# EAGLE design WordclockKopie (EAGLE 7.2.0)
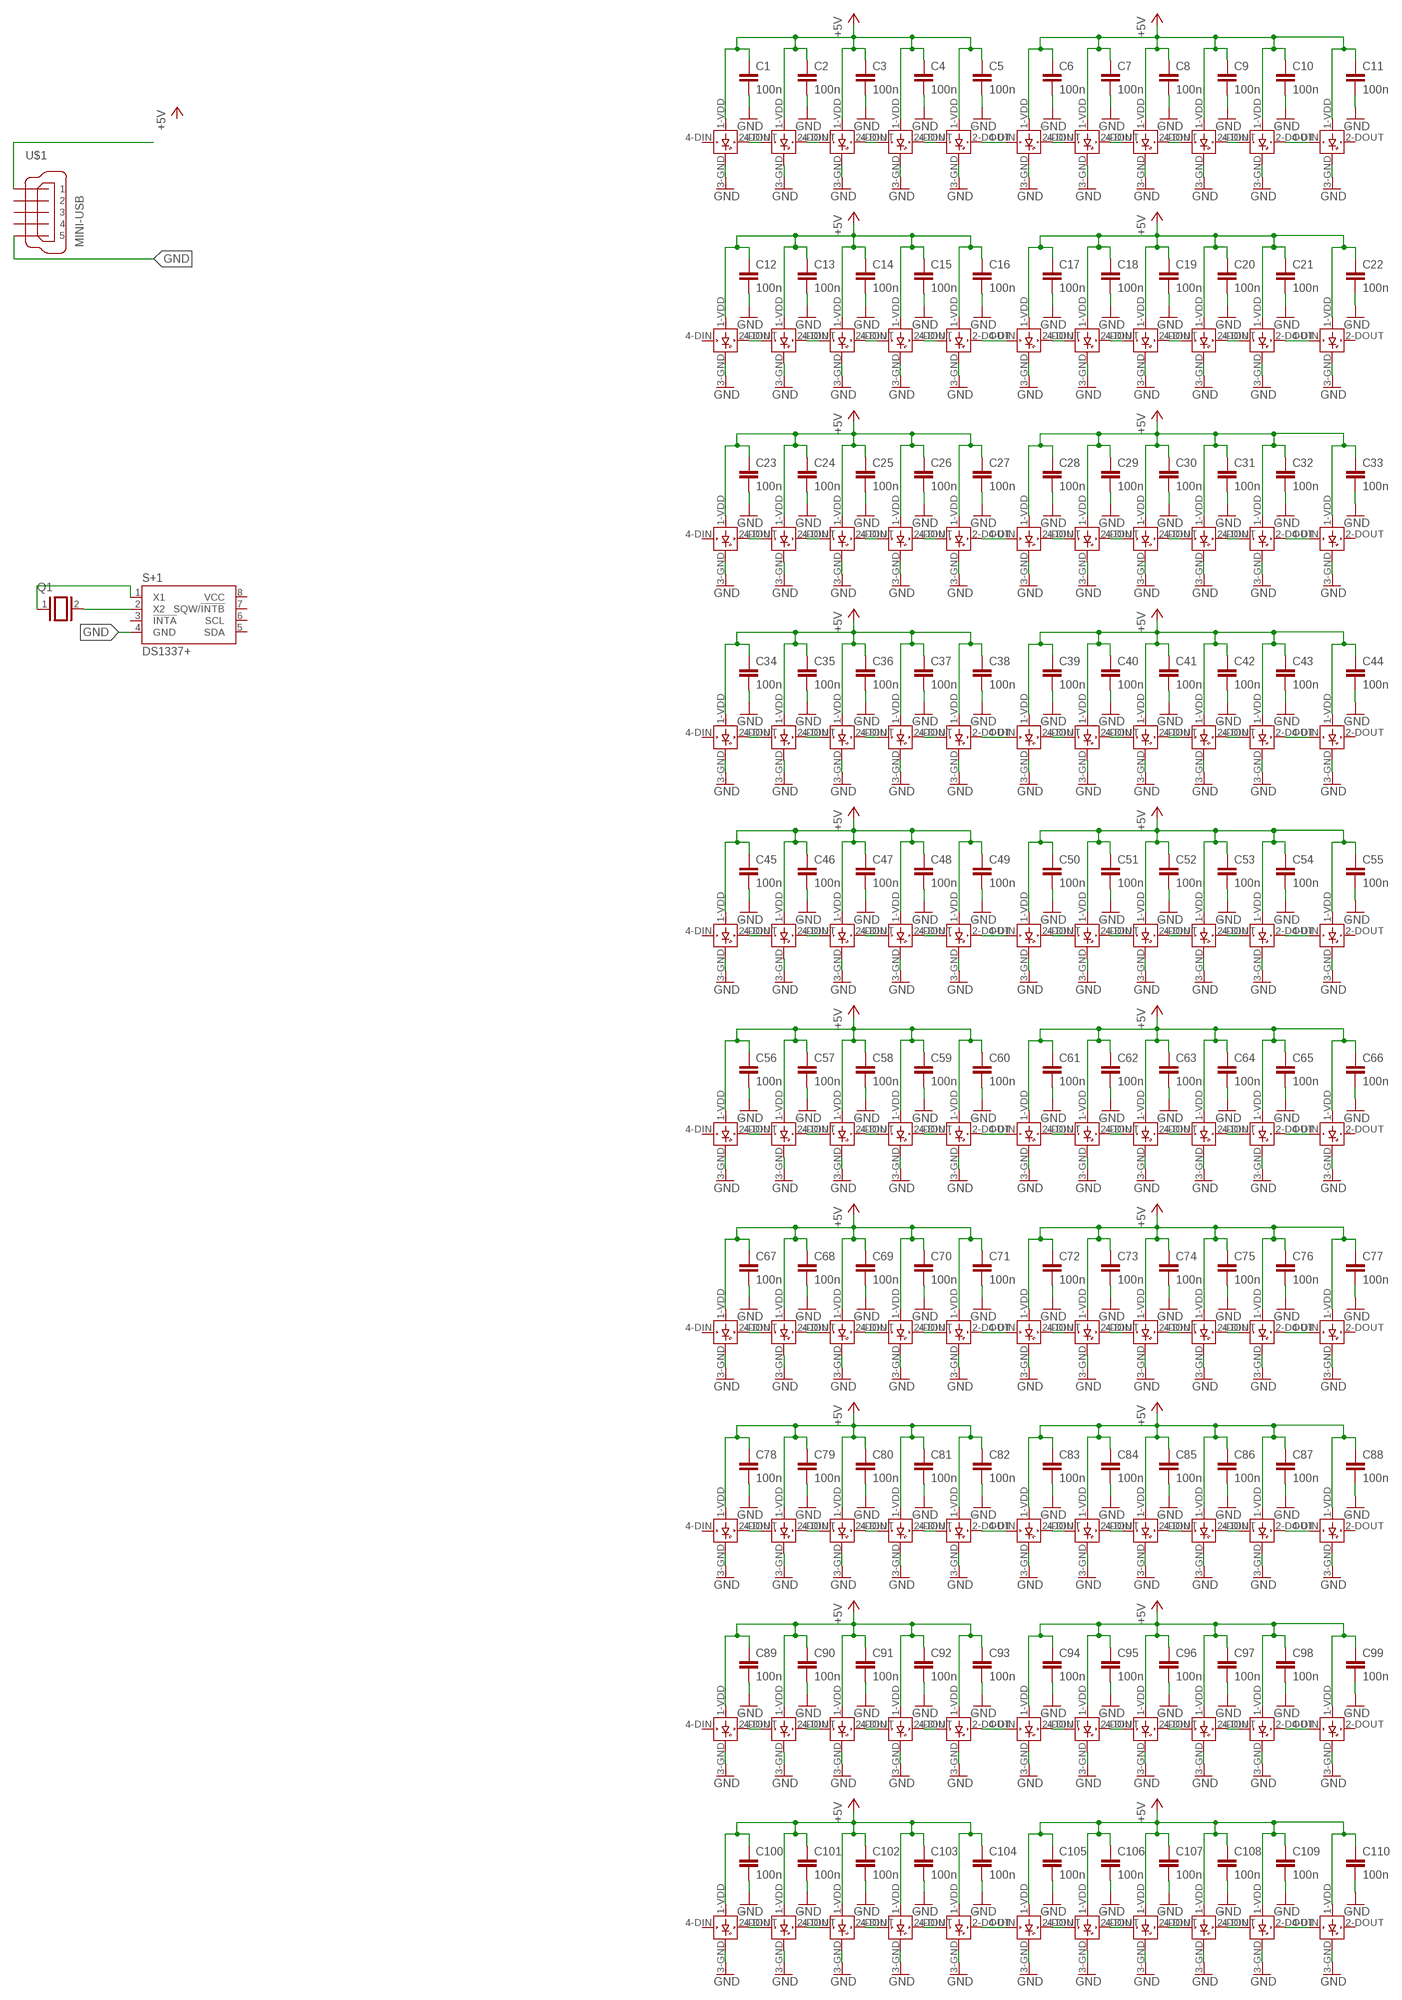
[diagram p0: schematic, sheet 1]

## Parts
C1  100n  C-EUC1310  [C1310]
C2  100n  C-EUC1310  [C1310]
C3  100n  C-EUC1310  [C1310]
C4  100n  C-EUC1310  [C1310]
C5  100n  C-EUC1310  [C1310]
C6  100n  C-EUC1310  [C1310]
C7  100n  C-EUC1310  [C1310]
C8  100n  C-EUC1310  [C1310]
C9  100n  C-EUC1310  [C1310]
C10  100n  C-EUC1310  [C1310]
C11  100n  C-EUC1310  [C1310]
C12  100n  C-EUC1310  [C1310]
C13  100n  C-EUC1310  [C1310]
C14  100n  C-EUC1310  [C1310]
C15  100n  C-EUC1310  [C1310]
C16  100n  C-EUC1310  [C1310]
C17  100n  C-EUC1310  [C1310]
C18  100n  C-EUC1310  [C1310]
C19  100n  C-EUC1310  [C1310]
C20  100n  C-EUC1310  [C1310]
C21  100n  C-EUC1310  [C1310]
C22  100n  C-EUC1310  [C1310]
C23  100n  C-EUC1310  [C1310]
C24  100n  C-EUC1310  [C1310]
C25  100n  C-EUC1310  [C1310]
C26  100n  C-EUC1310  [C1310]
C27  100n  C-EUC1310  [C1310]
C28  100n  C-EUC1310  [C1310]
C29  100n  C-EUC1310  [C1310]
C30  100n  C-EUC1310  [C1310]
C31  100n  C-EUC1310  [C1310]
C32  100n  C-EUC1310  [C1310]
C33  100n  C-EUC1310  [C1310]
C34  100n  C-EUC1310  [C1310]
C35  100n  C-EUC1310  [C1310]
C36  100n  C-EUC1310  [C1310]
C37  100n  C-EUC1310  [C1310]
C38  100n  C-EUC1310  [C1310]
C39  100n  C-EUC1310  [C1310]
C40  100n  C-EUC1310  [C1310]
C41  100n  C-EUC1310  [C1310]
C42  100n  C-EUC1310  [C1310]
C43  100n  C-EUC1310  [C1310]
C44  100n  C-EUC1310  [C1310]
C45  100n  C-EUC1310  [C1310]
C46  100n  C-EUC1310  [C1310]
C47  100n  C-EUC1310  [C1310]
C48  100n  C-EUC1310  [C1310]
C49  100n  C-EUC1310  [C1310]
C50  100n  C-EUC1310  [C1310]
C51  100n  C-EUC1310  [C1310]
C52  100n  C-EUC1310  [C1310]
C53  100n  C-EUC1310  [C1310]
C54  100n  C-EUC1310  [C1310]
C55  100n  C-EUC1310  [C1310]
C56  100n  C-EUC1310  [C1310]
C57  100n  C-EUC1310  [C1310]
C58  100n  C-EUC1310  [C1310]
C59  100n  C-EUC1310  [C1310]
C60  100n  C-EUC1310  [C1310]
C61  100n  C-EUC1310  [C1310]
C62  100n  C-EUC1310  [C1310]
C63  100n  C-EUC1310  [C1310]
C64  100n  C-EUC1310  [C1310]
C65  100n  C-EUC1310  [C1310]
C66  100n  C-EUC1310  [C1310]
C67  100n  C-EUC1310  [C1310]
C68  100n  C-EUC1310  [C1310]
C69  100n  C-EUC1310  [C1310]
C70  100n  C-EUC1310  [C1310]
C71  100n  C-EUC1310  [C1310]
C72  100n  C-EUC1310  [C1310]
C73  100n  C-EUC1310  [C1310]
C74  100n  C-EUC1310  [C1310]
C75  100n  C-EUC1310  [C1310]
C76  100n  C-EUC1310  [C1310]
C77  100n  C-EUC1310  [C1310]
C78  100n  C-EUC1310  [C1310]
C79  100n  C-EUC1310  [C1310]
C80  100n  C-EUC1310  [C1310]
C81  100n  C-EUC1310  [C1310]
C82  100n  C-EUC1310  [C1310]
C83  100n  C-EUC1310  [C1310]
C84  100n  C-EUC1310  [C1310]
C85  100n  C-EUC1310  [C1310]
C86  100n  C-EUC1310  [C1310]
C87  100n  C-EUC1310  [C1310]
C88  100n  C-EUC1310  [C1310]
C89  100n  C-EUC1310  [C1310]
C90  100n  C-EUC1310  [C1310]
C91  100n  C-EUC1310  [C1310]
C92  100n  C-EUC1310  [C1310]
C93  100n  C-EUC1310  [C1310]
C94  100n  C-EUC1310  [C1310]
C95  100n  C-EUC1310  [C1310]
C96  100n  C-EUC1310  [C1310]
C97  100n  C-EUC1310  [C1310]
C98  100n  C-EUC1310  [C1310]
C99  100n  C-EUC1310  [C1310]
C100  100n  C-EUC1310  [C1310]
C101  100n  C-EUC1310  [C1310]
C102  100n  C-EUC1310  [C1310]
C103  100n  C-EUC1310  [C1310]
C104  100n  C-EUC1310  [C1310]
C105  100n  C-EUC1310  [C1310]
C106  100n  C-EUC1310  [C1310]
C107  100n  C-EUC1310  [C1310]
C108  100n  C-EUC1310  [C1310]
C109  100n  C-EUC1310  [C1310]
C110  100n  C-EUC1310  [C1310]
L1  WS2812B  [WS2812B]
L2  WS2812B  [WS2812B]
L3  WS2812B  [WS2812B]
L4  WS2812B  [WS2812B]
L5  WS2812B  [WS2812B]
L6  WS2812B  [WS2812B]
L7  WS2812B  [WS2812B]
L8  WS2812B  [WS2812B]
L9  WS2812B  [WS2812B]
L10  WS2812B  [WS2812B]
L11  WS2812B  [WS2812B]
L12  WS2812B  [WS2812B]
L13  WS2812B  [WS2812B]
L14  WS2812B  [WS2812B]
L15  WS2812B  [WS2812B]
L16  WS2812B  [WS2812B]
L17  WS2812B  [WS2812B]
L18  WS2812B  [WS2812B]
L19  WS2812B  [WS2812B]
L20  WS2812B  [WS2812B]
L21  WS2812B  [WS2812B]
L22  WS2812B  [WS2812B]
L23  WS2812B  [WS2812B]
L24  WS2812B  [WS2812B]
L25  WS2812B  [WS2812B]
L26  WS2812B  [WS2812B]
L27  WS2812B  [WS2812B]
L28  WS2812B  [WS2812B]
L29  WS2812B  [WS2812B]
L30  WS2812B  [WS2812B]
L31  WS2812B  [WS2812B]
L32  WS2812B  [WS2812B]
L33  WS2812B  [WS2812B]
L34  WS2812B  [WS2812B]
L35  WS2812B  [WS2812B]
L36  WS2812B  [WS2812B]
L37  WS2812B  [WS2812B]
L38  WS2812B  [WS2812B]
L39  WS2812B  [WS2812B]
L40  WS2812B  [WS2812B]
L41  WS2812B  [WS2812B]
L42  WS2812B  [WS2812B]
L43  WS2812B  [WS2812B]
L44  WS2812B  [WS2812B]
L45  WS2812B  [WS2812B]
L46  WS2812B  [WS2812B]
L47  WS2812B  [WS2812B]
L48  WS2812B  [WS2812B]
L49  WS2812B  [WS2812B]
L50  WS2812B  [WS2812B]
L51  WS2812B  [WS2812B]
L52  WS2812B  [WS2812B]
L53  WS2812B  [WS2812B]
L54  WS2812B  [WS2812B]
L55  WS2812B  [WS2812B]
L56  WS2812B  [WS2812B]
L57  WS2812B  [WS2812B]
L58  WS2812B  [WS2812B]
L59  WS2812B  [WS2812B]
L60  WS2812B  [WS2812B]
L61  WS2812B  [WS2812B]
L62  WS2812B  [WS2812B]
L63  WS2812B  [WS2812B]
L64  WS2812B  [WS2812B]
L65  WS2812B  [WS2812B]
L66  WS2812B  [WS2812B]
L67  WS2812B  [WS2812B]
L68  WS2812B  [WS2812B]
L69  WS2812B  [WS2812B]
L70  WS2812B  [WS2812B]
L71  WS2812B  [WS2812B]
L72  WS2812B  [WS2812B]
L73  WS2812B  [WS2812B]
L74  WS2812B  [WS2812B]
L75  WS2812B  [WS2812B]
L76  WS2812B  [WS2812B]
L77  WS2812B  [WS2812B]
L78  WS2812B  [WS2812B]
L79  WS2812B  [WS2812B]
L80  WS2812B  [WS2812B]
L81  WS2812B  [WS2812B]
L82  WS2812B  [WS2812B]
L83  WS2812B  [WS2812B]
L84  WS2812B  [WS2812B]
L85  WS2812B  [WS2812B]
L86  WS2812B  [WS2812B]
L87  WS2812B  [WS2812B]
L88  WS2812B  [WS2812B]
L89  WS2812B  [WS2812B]
L90  WS2812B  [WS2812B]
L91  WS2812B  [WS2812B]
L92  WS2812B  [WS2812B]
L93  WS2812B  [WS2812B]
L94  WS2812B  [WS2812B]
L95  WS2812B  [WS2812B]
L96  WS2812B  [WS2812B]
L97  WS2812B  [WS2812B]
L98  WS2812B  [WS2812B]
L99  WS2812B  [WS2812B]
L100  WS2812B  [WS2812B]
L101  WS2812B  [WS2812B]
L102  WS2812B  [WS2812B]
L103  WS2812B  [WS2812B]
L104  WS2812B  [WS2812B]
L105  WS2812B  [WS2812B]
L106  WS2812B  [WS2812B]
L107  WS2812B  [WS2812B]
L108  WS2812B  [WS2812B]
L109  WS2812B  [WS2812B]
L110  WS2812B  [WS2812B]
Q1  XTAL  [Q]
S+1  DS1337+  [DIL8]
U$1  MINI-USB  [MINI-USB]

## Nets
+5V: C1.1 C2.1 C3.1 C4.1 C5.1 C6.1 C7.1 C8.1 C9.1 C10.1 C11.1 C12.1 C13.1 C14.1 C15.1 C16.1 C17.1 C18.1 C19.1 C20.1 C21.1 C22.1 C23.1 C24.1 C25.1 C26.1 C27.1 C28.1 C29.1 C30.1 C31.1 C32.1 C33.1 C34.1 C35.1 C36.1 C37.1 C38.1 C39.1 C40.1 C41.1 C42.1 C43.1 C44.1 C45.1 C46.1 C47.1 C48.1 C49.1 C50.1 C51.1 C52.1 C53.1 C54.1 C55.1 C56.1 C57.1 C58.1 C59.1 C60.1 C61.1 C62.1 C63.1 C64.1 C65.1 C66.1 C67.1 C68.1 C69.1 C70.1 C71.1 C72.1 C73.1 C74.1 C75.1 C76.1 C77.1 C78.1 C79.1 C80.1 C81.1 C82.1 C83.1 C84.1 C85.1 C86.1 C87.1 C88.1 C89.1 C90.1 C91.1 C92.1 C93.1 C94.1 C95.1 C96.1 C97.1 C98.1 C99.1 C100.1 C101.1 C102.1 C103.1 C104.1 C105.1 C106.1 C107.1 C108.1 C109.1 C110.1 L1.1-VDD(VDD) L2.1-VDD(VDD) L3.1-VDD(VDD) L4.1-VDD(VDD) L5.1-VDD(VDD) L6.1-VDD(VDD) L7.1-VDD(VDD) L8.1-VDD(VDD) L9.1-VDD(VDD) L10.1-VDD(VDD) L11.1-VDD(VDD) L12.1-VDD(VDD) L13.1-VDD(VDD) L14.1-VDD(VDD) L15.1-VDD(VDD) L16.1-VDD(VDD) L17.1-VDD(VDD) L18.1-VDD(VDD) L19.1-VDD(VDD) L20.1-VDD(VDD) L21.1-VDD(VDD) L22.1-VDD(VDD) L23.1-VDD(VDD) L24.1-VDD(VDD) L25.1-VDD(VDD) L26.1-VDD(VDD) L27.1-VDD(VDD) L28.1-VDD(VDD) L29.1-VDD(VDD) L30.1-VDD(VDD) L31.1-VDD(VDD) L32.1-VDD(VDD) L33.1-VDD(VDD) L34.1-VDD(VDD) L35.1-VDD(VDD) L36.1-VDD(VDD) L37.1-VDD(VDD) L38.1-VDD(VDD) L39.1-VDD(VDD) L40.1-VDD(VDD) L41.1-VDD(VDD) L42.1-VDD(VDD) L43.1-VDD(VDD) L44.1-VDD(VDD) L45.1-VDD(VDD) L46.1-VDD(VDD) L47.1-VDD(VDD) L48.1-VDD(VDD) L49.1-VDD(VDD) L50.1-VDD(VDD) L51.1-VDD(VDD) L52.1-VDD(VDD) L53.1-VDD(VDD) L54.1-VDD(VDD) L55.1-VDD(VDD) L56.1-VDD(VDD) L57.1-VDD(VDD) L58.1-VDD(VDD) L59.1-VDD(VDD) L60.1-VDD(VDD) L61.1-VDD(VDD) L62.1-VDD(VDD) L63.1-VDD(VDD) L64.1-VDD(VDD) L65.1-VDD(VDD) L66.1-VDD(VDD) L67.1-VDD(VDD) L68.1-VDD(VDD) L69.1-VDD(VDD) L70.1-VDD(VDD) L71.1-VDD(VDD) L72.1-VDD(VDD) L73.1-VDD(VDD) L74.1-VDD(VDD) L75.1-VDD(VDD) L76.1-VDD(VDD) L77.1-VDD(VDD) L78.1-VDD(VDD) L79.1-VDD(VDD) L80.1-VDD(VDD) L81.1-VDD(VDD) L82.1-VDD(VDD) L83.1-VDD(VDD) L84.1-VDD(VDD) L85.1-VDD(VDD) L86.1-VDD(VDD) L87.1-VDD(VDD) L88.1-VDD(VDD) L89.1-VDD(VDD) L90.1-VDD(VDD) L91.1-VDD(VDD) L92.1-VDD(VDD) L93.1-VDD(VDD) L94.1-VDD(VDD) L95.1-VDD(VDD) L96.1-VDD(VDD) L97.1-VDD(VDD) L98.1-VDD(VDD) L99.1-VDD(VDD) L100.1-VDD(VDD) L101.1-VDD(VDD) L102.1-VDD(VDD) L103.1-VDD(VDD) L104.1-VDD(VDD) L105.1-VDD(VDD) L106.1-VDD(VDD) L107.1-VDD(VDD) L108.1-VDD(VDD) L109.1-VDD(VDD) L110.1-VDD(VDD)
GND: C1.2 C2.2 C3.2 C4.2 C5.2 C6.2 C7.2 C8.2 C9.2 C10.2 C11.2 C12.2 C13.2 C14.2 C15.2 C16.2 C17.2 C18.2 C19.2 C20.2 C21.2 C22.2 C23.2 C24.2 C25.2 C26.2 C27.2 C28.2 C29.2 C30.2 C31.2 C32.2 C33.2 C34.2 C35.2 C36.2 C37.2 C38.2 C39.2 C40.2 C41.2 C42.2 C43.2 C44.2 C45.2 C46.2 C47.2 C48.2 C49.2 C50.2 C51.2 C52.2 C53.2 C54.2 C55.2 C56.2 C57.2 C58.2 C59.2 C60.2 C61.2 C62.2 C63.2 C64.2 C65.2 C66.2 C67.2 C68.2 C69.2 C70.2 C71.2 C72.2 C73.2 C74.2 C75.2 C76.2 C77.2 C78.2 C79.2 C80.2 C81.2 C82.2 C83.2 C84.2 C85.2 C86.2 C87.2 C88.2 C89.2 C90.2 C91.2 C92.2 C93.2 C94.2 C95.2 C96.2 C97.2 C98.2 C99.2 C100.2 C101.2 C102.2 C103.2 C104.2 C105.2 C106.2 C107.2 C108.2 C109.2 C110.2 L1.3-GND(GND) L2.3-GND(GND) L3.3-GND(GND) L4.3-GND(GND) L5.3-GND(GND) L6.3-GND(GND) L7.3-GND(GND) L8.3-GND(GND) L9.3-GND(GND) L10.3-GND(GND) L11.3-GND(GND) L12.3-GND(GND) L13.3-GND(GND) L14.3-GND(GND) L15.3-GND(GND) L16.3-GND(GND) L17.3-GND(GND) L18.3-GND(GND) L19.3-GND(GND) L20.3-GND(GND) L21.3-GND(GND) L22.3-GND(GND) L23.3-GND(GND) L24.3-GND(GND) L25.3-GND(GND) L26.3-GND(GND) L27.3-GND(GND) L28.3-GND(GND) L29.3-GND(GND) L30.3-GND(GND) L31.3-GND(GND) L32.3-GND(GND) L33.3-GND(GND) L34.3-GND(GND) L35.3-GND(GND) L36.3-GND(GND) L37.3-GND(GND) L38.3-GND(GND) L39.3-GND(GND) L40.3-GND(GND) L41.3-GND(GND) L42.3-GND(GND) L43.3-GND(GND) L44.3-GND(GND) L45.3-GND(GND) L46.3-GND(GND) L47.3-GND(GND) L48.3-GND(GND) L49.3-GND(GND) L50.3-GND(GND) L51.3-GND(GND) L52.3-GND(GND) L53.3-GND(GND) L54.3-GND(GND) L55.3-GND(GND) L56.3-GND(GND) L57.3-GND(GND) L58.3-GND(GND) L59.3-GND(GND) L60.3-GND(GND) L61.3-GND(GND) L62.3-GND(GND) L63.3-GND(GND) L64.3-GND(GND) L65.3-GND(GND) L66.3-GND(GND) L67.3-GND(GND) L68.3-GND(GND) L69.3-GND(GND) L70.3-GND(GND) L71.3-GND(GND) L72.3-GND(GND) L73.3-GND(GND) L74.3-GND(GND) L75.3-GND(GND) L76.3-GND(GND) L77.3-GND(GND) L78.3-GND(GND) L79.3-GND(GND) L80.3-GND(GND) L81.3-GND(GND) L82.3-GND(GND) L83.3-GND(GND) L84.3-GND(GND) L85.3-GND(GND) L86.3-GND(GND) L87.3-GND(GND) L88.3-GND(GND) L89.3-GND(GND) L90.3-GND(GND) L91.3-GND(GND) L92.3-GND(GND) L93.3-GND(GND) L94.3-GND(GND) L95.3-GND(GND) L96.3-GND(GND) L97.3-GND(GND) L98.3-GND(GND) L99.3-GND(GND) L100.3-GND(GND) L101.3-GND(GND) L102.3-GND(GND) L103.3-GND(GND) L104.3-GND(GND) L105.3-GND(GND) L106.3-GND(GND) L107.3-GND(GND) L108.3-GND(GND) L109.3-GND(GND) L110.3-GND(GND) S+1.4(GND) U$1.5
N$1: L1.2-DOUT(DOUT) L2.4-DIN(DIN)
N$2: L2.2-DOUT(DOUT) L3.4-DIN(DIN)
N$3: L3.2-DOUT(DOUT) L4.4-DIN(DIN)
N$4: L4.2-DOUT(DOUT) L5.4-DIN(DIN)
N$5: L6.2-DOUT(DOUT) L7.4-DIN(DIN)
N$6: L5.2-DOUT(DOUT) L6.4-DIN(DIN)
N$7: L7.2-DOUT(DOUT) L8.4-DIN(DIN)
N$8: L8.2-DOUT(DOUT) L9.4-DIN(DIN)
N$9: L9.2-DOUT(DOUT) L10.4-DIN(DIN)
N$10: L10.2-DOUT(DOUT) L11.4-DIN(DIN)
N$13: L12.2-DOUT(DOUT) L13.4-DIN(DIN)
N$14: L13.2-DOUT(DOUT) L14.4-DIN(DIN)
N$15: L14.2-DOUT(DOUT) L15.4-DIN(DIN)
N$16: L15.2-DOUT(DOUT) L16.4-DIN(DIN)
N$17: L16.2-DOUT(DOUT) L17.4-DIN(DIN)
N$18: L17.2-DOUT(DOUT) L18.4-DIN(DIN)
N$19: L18.2-DOUT(DOUT) L19.4-DIN(DIN)
N$20: Q1.1 S+1.1(X1)
N$21: Q1.2 S+1.2(X2)
N$22: L19.2-DOUT(DOUT) L20.4-DIN(DIN)
N$23: L20.2-DOUT(DOUT) L21.4-DIN(DIN)
N$24: L21.2-DOUT(DOUT) L22.4-DIN(DIN)
N$27: L23.2-DOUT(DOUT) L24.4-DIN(DIN)
N$28: L24.2-DOUT(DOUT) L25.4-DIN(DIN)
N$29: L25.2-DOUT(DOUT) L26.4-DIN(DIN)
N$30: L26.2-DOUT(DOUT) L27.4-DIN(DIN)
N$31: L27.2-DOUT(DOUT) L28.4-DIN(DIN)
N$32: L28.2-DOUT(DOUT) L29.4-DIN(DIN)
N$33: L29.2-DOUT(DOUT) L30.4-DIN(DIN)
N$34: L30.2-DOUT(DOUT) L31.4-DIN(DIN)
N$35: L31.2-DOUT(DOUT) L32.4-DIN(DIN)
N$36: L32.2-DOUT(DOUT) L33.4-DIN(DIN)
N$39: L34.2-DOUT(DOUT) L35.4-DIN(DIN)
N$40: L35.2-DOUT(DOUT) L36.4-DIN(DIN)
N$41: L36.2-DOUT(DOUT) L37.4-DIN(DIN)
N$42: L37.2-DOUT(DOUT) L38.4-DIN(DIN)
N$43: L38.2-DOUT(DOUT) L39.4-DIN(DIN)
N$44: L39.2-DOUT(DOUT) L40.4-DIN(DIN)
N$45: L40.2-DOUT(DOUT) L41.4-DIN(DIN)
N$46: L41.2-DOUT(DOUT) L42.4-DIN(DIN)
N$47: L42.2-DOUT(DOUT) L43.4-DIN(DIN)
N$48: L43.2-DOUT(DOUT) L44.4-DIN(DIN)
N$51: L45.2-DOUT(DOUT) L46.4-DIN(DIN)
N$52: L46.2-DOUT(DOUT) L47.4-DIN(DIN)
N$53: L47.2-DOUT(DOUT) L48.4-DIN(DIN)
N$54: L48.2-DOUT(DOUT) L49.4-DIN(DIN)
N$55: L49.2-DOUT(DOUT) L50.4-DIN(DIN)
N$56: L50.2-DOUT(DOUT) L51.4-DIN(DIN)
N$57: L51.2-DOUT(DOUT) L52.4-DIN(DIN)
N$58: L52.2-DOUT(DOUT) L53.4-DIN(DIN)
N$59: L53.2-DOUT(DOUT) L54.4-DIN(DIN)
N$60: L54.2-DOUT(DOUT) L55.4-DIN(DIN)
N$63: L56.2-DOUT(DOUT) L57.4-DIN(DIN)
N$64: L57.2-DOUT(DOUT) L58.4-DIN(DIN)
N$65: L58.2-DOUT(DOUT) L59.4-DIN(DIN)
N$66: L59.2-DOUT(DOUT) L60.4-DIN(DIN)
N$67: L60.2-DOUT(DOUT) L61.4-DIN(DIN)
N$68: L61.2-DOUT(DOUT) L62.4-DIN(DIN)
N$69: L62.2-DOUT(DOUT) L63.4-DIN(DIN)
N$70: L63.2-DOUT(DOUT) L64.4-DIN(DIN)
N$71: L64.2-DOUT(DOUT) L65.4-DIN(DIN)
N$72: L65.2-DOUT(DOUT) L66.4-DIN(DIN)
N$75: L67.2-DOUT(DOUT) L68.4-DIN(DIN)
N$76: L68.2-DOUT(DOUT) L69.4-DIN(DIN)
N$77: L69.2-DOUT(DOUT) L70.4-DIN(DIN)
N$78: L70.2-DOUT(DOUT) L71.4-DIN(DIN)
N$79: L71.2-DOUT(DOUT) L72.4-DIN(DIN)
N$80: L72.2-DOUT(DOUT) L73.4-DIN(DIN)
N$81: L73.2-DOUT(DOUT) L74.4-DIN(DIN)
N$82: L74.2-DOUT(DOUT) L75.4-DIN(DIN)
N$83: L75.2-DOUT(DOUT) L76.4-DIN(DIN)
N$84: L76.2-DOUT(DOUT) L77.4-DIN(DIN)
N$87: L78.2-DOUT(DOUT) L79.4-DIN(DIN)
N$88: L79.2-DOUT(DOUT) L80.4-DIN(DIN)
N$89: L80.2-DOUT(DOUT) L81.4-DIN(DIN)
N$90: L81.2-DOUT(DOUT) L82.4-DIN(DIN)
N$91: L82.2-DOUT(DOUT) L83.4-DIN(DIN)
N$92: L83.2-DOUT(DOUT) L84.4-DIN(DIN)
N$93: L84.2-DOUT(DOUT) L85.4-DIN(DIN)
N$94: L85.2-DOUT(DOUT) L86.4-DIN(DIN)
N$95: L86.2-DOUT(DOUT) L87.4-DIN(DIN)
N$96: L87.2-DOUT(DOUT) L88.4-DIN(DIN)
N$99: L89.2-DOUT(DOUT) L90.4-DIN(DIN)
N$100: L90.2-DOUT(DOUT) L91.4-DIN(DIN)
N$101: L91.2-DOUT(DOUT) L92.4-DIN(DIN)
N$102: L92.2-DOUT(DOUT) L93.4-DIN(DIN)
N$103: L93.2-DOUT(DOUT) L94.4-DIN(DIN)
N$104: L94.2-DOUT(DOUT) L95.4-DIN(DIN)
N$105: L95.2-DOUT(DOUT) L96.4-DIN(DIN)
N$106: L96.2-DOUT(DOUT) L97.4-DIN(DIN)
N$107: L97.2-DOUT(DOUT) L98.4-DIN(DIN)
N$108: L98.2-DOUT(DOUT) L99.4-DIN(DIN)
N$111: L100.2-DOUT(DOUT) L101.4-DIN(DIN)
N$112: L101.2-DOUT(DOUT) L102.4-DIN(DIN)
N$113: L102.2-DOUT(DOUT) L103.4-DIN(DIN)
N$114: L103.2-DOUT(DOUT) L104.4-DIN(DIN)
N$115: L104.2-DOUT(DOUT) L105.4-DIN(DIN)
N$116: L105.2-DOUT(DOUT) L106.4-DIN(DIN)
N$117: L106.2-DOUT(DOUT) L107.4-DIN(DIN)
N$118: L107.2-DOUT(DOUT) L108.4-DIN(DIN)
N$119: L108.2-DOUT(DOUT) L109.4-DIN(DIN)
N$120: L109.2-DOUT(DOUT) L110.4-DIN(DIN)
VCC: U$1.1
Unconnected: L1.4-DIN(DIN) L11.2-DOUT(DOUT) L12.4-DIN(DIN) L22.2-DOUT(DOUT) L23.4-DIN(DIN) L33.2-DOUT(DOUT) L34.4-DIN(DIN) L44.2-DOUT(DOUT) L45.4-DIN(DIN) L55.2-DOUT(DOUT) L56.4-DIN(DIN) L66.2-DOUT(DOUT) L67.4-DIN(DIN) L77.2-DOUT(DOUT) L78.4-DIN(DIN) L88.2-DOUT(DOUT) L89.4-DIN(DIN) L99.2-DOUT(DOUT) L100.4-DIN(DIN) L110.2-DOUT(DOUT) S+1.3(!INTA) S+1.5(SDA) S+1.6(SCL) S+1.7(SQW/!INTB!) S+1.8(VCC) U$1.2 U$1.3 U$1.4

## Library data of the parts
C1-C110 = rcl:C-EU: CAPACITOR, European symbol
L1-L110 = adafruit:WS2812B
Q1 = special:XTAL: CRYSTAL
S+1 = eagle-library-edeca.net-v5:DS1337: DS1337 I2C serial real-time clock Low-power clock/calendar with two programmable time-of-day alarms and a programmable square-wave output. http://pdfserv.maxim-ic.com/en/ds/DS1337-DS1337C.pdf
U$1 = eagle-library-edeca.net-v5:MINI-USB: Mini USB connector (Kyocera part: 24 5141 005 000 863+) Farnell order code: 1558179

## Board
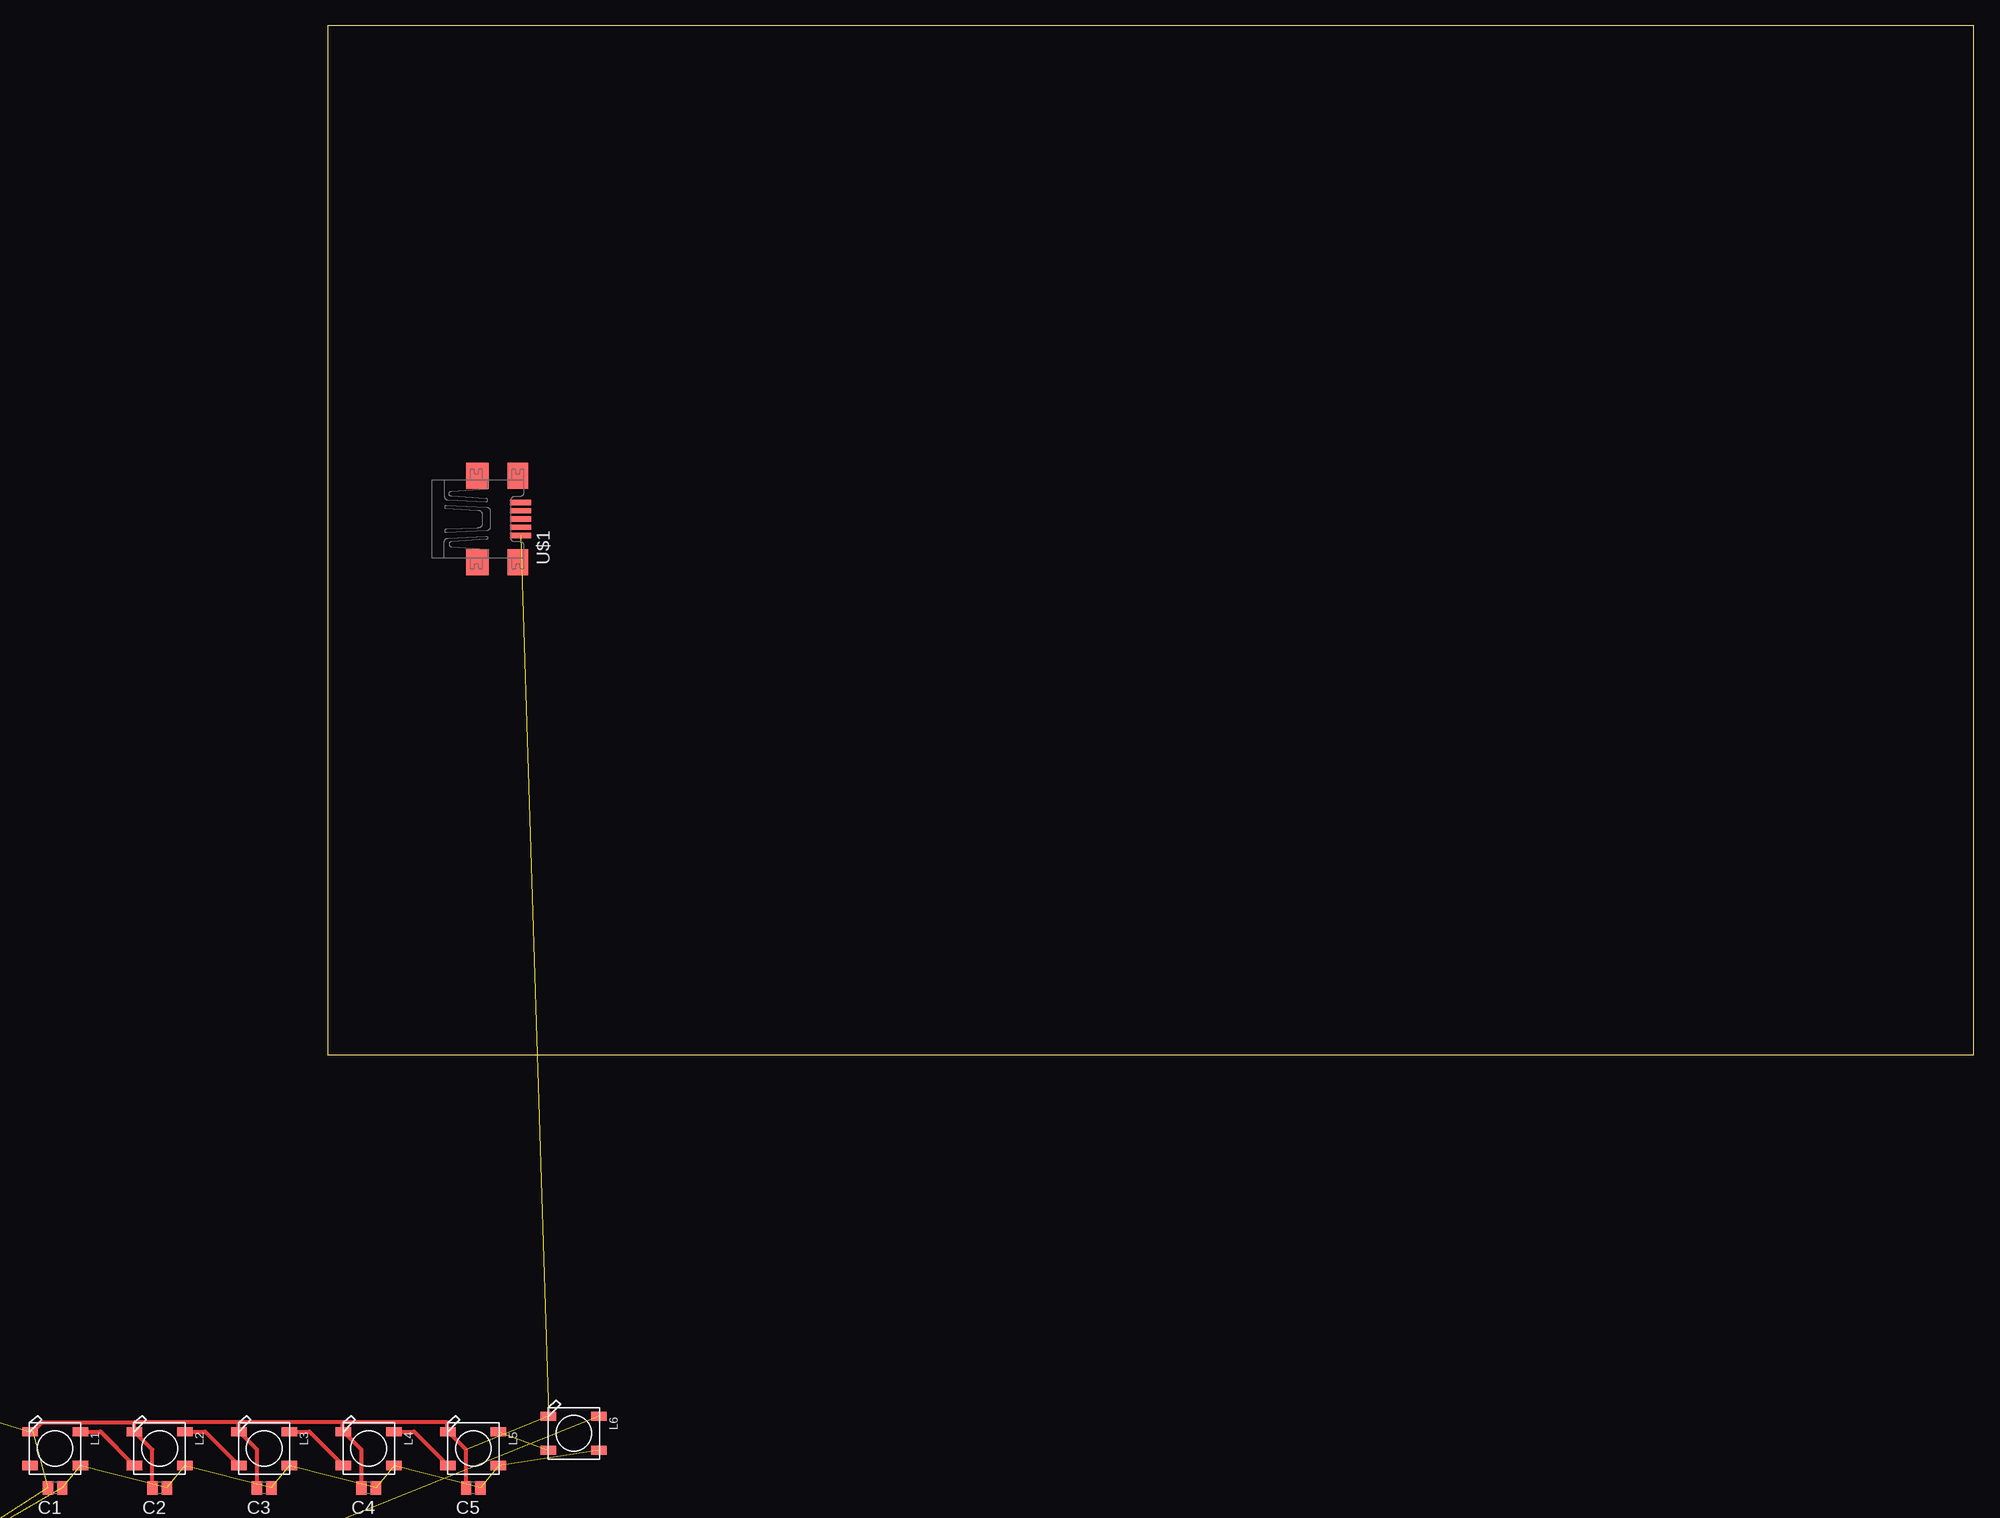
[diagram p1: board, top side]

Size 160 x 100 mm. Coordinates in mm from the lower left corner, seen from the top.
Outline: 0,0 160,0 160,100 0,100 0,0
Copper layers (1*16): Top 0.035mm / dielectric 1.5mm / Bottom 0.035mm
Design rules "default": minimum track width 10mil, minimum drill 24mil, track to track 8mil, track to pad 8mil, pad to pad 8mil, via to via 8mil, smd to smd 8mil, copper to edge 40mil, drill to drill 8mil, minimum pad ring 10mil, minimum via ring 8mil, stop-mask expansion 4mil, vias tented up to drill 0mil, thermal gap 10mil

### Footprints (pad centres in the part's own frame; a part is rotated, then mirrored left to right if it is on the bottom)
C1310 = smd 1 x 1.3: 1 -0.7,0; 2 0.7,0
WS2812B = smd 1.5 x 0.9: 1-VDD 2.45,-1.65; 2-DOUT 2.45,1.65; 3-GND -2.45,1.65; 4-DIN -2.45,-1.65
Q = drill 0.61 long: 1 -2.54,-7.62; 2 2.54,-7.62
DIL8 = drill 0.813 long: 1 -3.81,-3.81; 2 -1.27,-3.81; 3 1.27,-3.81; 4 3.81,-3.81; 5 3.81,3.81; 6 1.27,3.81; 7 -1.27,3.81; 8 -3.81,3.81
MINI-USB = smd 2 x 0.5: 1 2.25,1.6; 2 2.25,0.8; 3 2.25,0; 4 2.25,-0.8; 5 2.25,-1.6 | smd 2.2 x 2.5: M1 -1.95,-4.2; M2 -1.95,4.2 | smd 2 x 2.5: M3 2,4.2; M4 2,-4.2

### Placement (x,y rotation side)
C1  -26.48,-42.07 180 top  (outside the outline)
C2  -16.32,-42.07 180 top  (outside the outline)
C3  -6.16,-42.07 180 top  (outside the outline)
C4  4,-42.07 180 top  (outside the outline)
C5  14.16,-42.07 180 top  (outside the outline)
C6  -66.04,-58.42 0 top  (outside the outline)
C7  -59.69,-58.42 0 top  (outside the outline)
C8  -53.34,-58.42 0 top  (outside the outline)
C9  -66.04,-64.77 0 top  (outside the outline)
C10  -59.69,-64.77 0 top  (outside the outline)
C11  -66.04,-90.17 0 top  (outside the outline)
C12  -66.04,-96.52 0 top  (outside the outline)
C13  -59.69,-96.52 0 top  (outside the outline)
C14  -53.34,-96.52 0 top  (outside the outline)
C15  -46.99,-96.52 0 top  (outside the outline)
C16  -40.64,-96.52 0 top  (outside the outline)
C17  -66.04,-102.87 0 top  (outside the outline)
C18  -59.69,-102.87 0 top  (outside the outline)
C19  -53.34,-102.87 0 top  (outside the outline)
C20  -46.99,-102.87 0 top  (outside the outline)
C21  -40.64,-102.87 0 top  (outside the outline)
C22  -66.04,-109.22 0 top  (outside the outline)
C23  -66.04,-134.62 0 top  (outside the outline)
C24  -59.69,-134.62 0 top  (outside the outline)
C25  -53.34,-134.62 0 top  (outside the outline)
C26  -46.99,-134.62 0 top  (outside the outline)
C27  -40.64,-134.62 0 top  (outside the outline)
C28  -34.29,-134.62 0 top  (outside the outline)
C29  -27.94,-134.62 0 top  (outside the outline)
C30  -66.04,-140.97 0 top  (outside the outline)
C31  -59.69,-140.97 0 top  (outside the outline)
C32  -53.34,-140.97 0 top  (outside the outline)
C33  -46.99,-140.97 0 top  (outside the outline)
C34  -40.64,-140.97 0 top  (outside the outline)
C35  -34.29,-140.97 0 top  (outside the outline)
C36  -27.94,-140.97 0 top  (outside the outline)
C37  -66.04,-147.32 0 top  (outside the outline)
C38  -59.69,-147.32 0 top  (outside the outline)
C39  -53.34,-147.32 0 top  (outside the outline)
C40  -46.99,-147.32 0 top  (outside the outline)
C41  -40.64,-147.32 0 top  (outside the outline)
C42  -34.29,-147.32 0 top  (outside the outline)
C43  -27.94,-147.32 0 top  (outside the outline)
C44  -66.04,-153.67 0 top  (outside the outline)
C45  -66.04,-185.42 0 top  (outside the outline)
C46  -59.69,-185.42 0 top  (outside the outline)
C47  -53.34,-185.42 0 top  (outside the outline)
C48  -46.99,-185.42 0 top  (outside the outline)
C49  -40.64,-185.42 0 top  (outside the outline)
C50  -34.29,-185.42 0 top  (outside the outline)
C51  -27.94,-185.42 0 top  (outside the outline)
C52  -21.59,-185.42 0 top  (outside the outline)
C53  -15.24,-185.42 0 top  (outside the outline)
C54  -8.89,-185.42 0 top  (outside the outline)
C55  -66.04,-191.77 0 top  (outside the outline)
C56  -59.69,-191.77 0 top  (outside the outline)
C57  -53.34,-191.77 0 top  (outside the outline)
C58  -46.99,-191.77 0 top  (outside the outline)
C59  -40.64,-191.77 0 top  (outside the outline)
C60  -34.29,-191.77 0 top  (outside the outline)
C61  -27.94,-191.77 0 top  (outside the outline)
C62  -21.59,-191.77 0 top  (outside the outline)
C63  -15.24,-191.77 0 top  (outside the outline)
C64  -8.89,-191.77 0 top  (outside the outline)
C65  -66.04,-198.12 0 top  (outside the outline)
C66  -59.69,-198.12 0 top  (outside the outline)
C67  -53.34,-198.12 0 top  (outside the outline)
C68  -46.99,-198.12 0 top  (outside the outline)
C69  -40.64,-198.12 0 top  (outside the outline)
C70  -34.29,-198.12 0 top  (outside the outline)
C71  -27.94,-198.12 0 top  (outside the outline)
C72  -21.59,-198.12 0 top  (outside the outline)
C73  -15.24,-198.12 0 top  (outside the outline)
C74  -8.89,-198.12 0 top  (outside the outline)
C75  -66.04,-204.47 0 top  (outside the outline)
C76  -59.69,-204.47 0 top  (outside the outline)
C77  -53.34,-204.47 0 top  (outside the outline)
C78  -46.99,-204.47 0 top  (outside the outline)
C79  -40.64,-204.47 0 top  (outside the outline)
C80  -34.29,-204.47 0 top  (outside the outline)
C81  -27.94,-204.47 0 top  (outside the outline)
C82  -21.59,-204.47 0 top  (outside the outline)
C83  -15.24,-204.47 0 top  (outside the outline)
C84  -8.89,-204.47 0 top  (outside the outline)
C85  -66.04,-210.82 0 top  (outside the outline)
C86  -59.69,-210.82 0 top  (outside the outline)
C87  -53.34,-210.82 0 top  (outside the outline)
C88  -46.99,-210.82 0 top  (outside the outline)
C89  -40.64,-261.62 0 top  (outside the outline)
C90  -34.29,-261.62 0 top  (outside the outline)
C91  -27.94,-261.62 0 top  (outside the outline)
C92  -66.04,-267.97 0 top  (outside the outline)
C93  -59.69,-267.97 0 top  (outside the outline)
C94  -53.34,-267.97 0 top  (outside the outline)
C95  -46.99,-267.97 0 top  (outside the outline)
C96  -40.64,-267.97 0 top  (outside the outline)
C97  -34.29,-267.97 0 top  (outside the outline)
C98  -27.94,-267.97 0 top  (outside the outline)
C99  -66.04,-274.32 0 top  (outside the outline)
C100  -66.04,-255.27 0 top  (outside the outline)
C101  -59.69,-255.27 0 top  (outside the outline)
C102  -53.34,-255.27 0 top  (outside the outline)
C103  -46.99,-255.27 0 top  (outside the outline)
C104  -40.64,-255.27 0 top  (outside the outline)
C105  -34.29,-255.27 0 top  (outside the outline)
C106  -27.94,-255.27 0 top  (outside the outline)
C107  -66.04,-261.62 0 top  (outside the outline)
C108  -59.69,-261.62 0 top  (outside the outline)
C109  -53.34,-261.62 0 top  (outside the outline)
C110  -46.99,-261.62 0 top  (outside the outline)
L1  -26.48,-38.26 0 top  (outside the outline)
L2  -16.32,-38.26 0 top  (outside the outline)
L3  -6.16,-38.26 0 top  (outside the outline)
L4  4,-38.26 0 top  (outside the outline)
L5  14.16,-38.26 0 top  (outside the outline)
L6  23.93,-36.77 0 top  (outside the outline)
L7  -64.77,-71.12 0 top  (outside the outline)
L8  -55.88,-71.12 0 top  (outside the outline)
L9  -64.77,-77.47 0 top  (outside the outline)
L10  -55.88,-77.47 0 top  (outside the outline)
L11  -64.77,-83.82 0 top  (outside the outline)
L12  -58.42,-109.22 0 top  (outside the outline)
L13  -49.53,-109.22 0 top  (outside the outline)
L14  -40.64,-109.22 0 top  (outside the outline)
L15  -64.77,-115.57 0 top  (outside the outline)
L16  -55.88,-115.57 0 top  (outside the outline)
L17  -46.99,-115.57 0 top  (outside the outline)
L18  -64.77,-121.92 0 top  (outside the outline)
L19  -55.88,-121.92 0 top  (outside the outline)
L20  -38.24,-121.92 0 top  (outside the outline)
L21  -64.77,-128.27 0 top  (outside the outline)
L22  -55.88,-128.27 0 top  (outside the outline)
L23  -58.42,-153.67 0 top  (outside the outline)
L24  -49.53,-153.67 0 top  (outside the outline)
L25  -40.64,-153.67 0 top  (outside the outline)
L26  -31.75,-153.67 0 top  (outside the outline)
L27  -64.77,-160.02 0 top  (outside the outline)
L28  -55.88,-160.02 0 top  (outside the outline)
L29  -46.99,-160.02 0 top  (outside the outline)
L30  -38.1,-160.02 0 top  (outside the outline)
L31  -29.21,-160.02 0 top  (outside the outline)
L32  -64.77,-166.37 0 top  (outside the outline)
L33  -55.88,-166.37 0 top  (outside the outline)
L34  -46.99,-166.37 0 top  (outside the outline)
L35  -38.1,-166.37 0 top  (outside the outline)
L36  -29.21,-166.37 0 top  (outside the outline)
L37  -64.77,-172.72 0 top  (outside the outline)
L38  -55.88,-172.72 0 top  (outside the outline)
L39  -46.99,-172.72 0 top  (outside the outline)
L40  -38.1,-172.72 0 top  (outside the outline)
L41  -29.21,-172.72 0 top  (outside the outline)
L42  -64.77,-179.07 0 top  (outside the outline)
L43  -55.88,-179.07 0 top  (outside the outline)
L44  -46.99,-179.07 0 top  (outside the outline)
L45  -39.37,-210.82 0 top  (outside the outline)
L46  -30.48,-210.82 0 top  (outside the outline)
L47  -21.59,-210.82 0 top  (outside the outline)
L48  -12.7,-210.82 0 top  (outside the outline)
L49  -64.77,-217.17 0 top  (outside the outline)
L50  -55.88,-217.17 0 top  (outside the outline)
L51  -46.99,-217.17 0 top  (outside the outline)
L52  -38.1,-217.17 0 top  (outside the outline)
L53  -29.21,-217.17 0 top  (outside the outline)
L54  -20.32,-217.17 0 top  (outside the outline)
L55  -11.43,-217.17 0 top  (outside the outline)
L56  -64.77,-223.52 0 top  (outside the outline)
L57  -55.88,-223.52 0 top  (outside the outline)
L58  -46.99,-223.52 0 top  (outside the outline)
L59  -38.1,-223.52 0 top  (outside the outline)
L60  -29.21,-223.52 0 top  (outside the outline)
L61  -20.32,-223.52 0 top  (outside the outline)
L62  -11.43,-223.52 0 top  (outside the outline)
L63  -64.77,-229.87 0 top  (outside the outline)
L64  -55.88,-229.87 0 top  (outside the outline)
L65  -46.99,-229.87 0 top  (outside the outline)
L66  -38.1,-229.87 0 top  (outside the outline)
L67  -29.21,-229.87 0 top  (outside the outline)
L68  -20.32,-229.87 0 top  (outside the outline)
L69  -11.43,-229.87 0 top  (outside the outline)
L70  -64.77,-236.22 0 top  (outside the outline)
L71  -55.88,-236.22 0 top  (outside the outline)
L72  -46.99,-236.22 0 top  (outside the outline)
L73  -38.1,-236.22 0 top  (outside the outline)
L74  -29.21,-236.22 0 top  (outside the outline)
L75  -20.32,-236.22 0 top  (outside the outline)
L76  -11.43,-236.22 0 top  (outside the outline)
L77  -64.77,-242.57 0 top  (outside the outline)
L78  -55.88,-242.57 0 top  (outside the outline)
L79  -46.99,-242.57 0 top  (outside the outline)
L80  -38.1,-242.57 0 top  (outside the outline)
L81  -29.21,-242.57 0 top  (outside the outline)
L82  -20.32,-242.57 0 top  (outside the outline)
L83  -11.43,-242.57 0 top  (outside the outline)
L84  -64.77,-248.92 0 top  (outside the outline)
L85  -55.88,-248.92 0 top  (outside the outline)
L86  -46.99,-248.92 0 top  (outside the outline)
L87  -38.1,-248.92 0 top  (outside the outline)
L88  -29.21,-248.92 0 top  (outside the outline)
L89  -58.42,-274.32 0 top  (outside the outline)
L90  -49.53,-274.32 0 top  (outside the outline)
L91  -40.64,-274.32 0 top  (outside the outline)
L92  -31.75,-274.32 0 top  (outside the outline)
L93  -64.77,-280.67 0 top  (outside the outline)
L94  -55.88,-280.67 0 top  (outside the outline)
L95  -46.99,-280.67 0 top  (outside the outline)
L96  -38.1,-280.67 0 top  (outside the outline)
L97  -29.21,-280.67 0 top  (outside the outline)
L98  -64.77,-287.02 0 top  (outside the outline)
L99  -55.88,-287.02 0 top  (outside the outline)
L100  -46.99,-287.02 0 top  (outside the outline)
L101  -38.1,-287.02 0 top  (outside the outline)
L102  -29.21,-287.02 0 top  (outside the outline)
L103  -64.77,-293.37 0 top  (outside the outline)
L104  -55.88,-293.37 0 top  (outside the outline)
L105  -46.99,-293.37 0 top  (outside the outline)
L106  -38.1,-293.37 0 top  (outside the outline)
L107  -29.21,-293.37 0 top  (outside the outline)
L108  -64.77,-299.72 0 top  (outside the outline)
L109  -55.88,-299.72 0 top  (outside the outline)
L110  -46.99,-299.72 0 top  (outside the outline)
Q1  -44.45,-34.29 0 top  (outside the outline)
S+1  -60.96,-24.13 0 top  (outside the outline)
U$1  16.51,52.07 0 top

### Tracks (layer width: path | path; a pad name or v marks a point on that pad's centre or on a via)
+5V  (219 unrouted)
GND  (213 unrouted)
  Top 0.406: L1.3-GND -28.64,-36.61 -27.75,-35.72 -18.86,-35.72 | -8.7,-35.72 -18.86,-35.72 | -18.86,-35.72 -18.86,-36.52 L2.3-GND -17.02,-38.36 C2.2 | -8.7,-35.72 -8.7,-36.52 L3.3-GND -6.86,-38.36 C3.2 | C4.2 3.3,-38.36 L4.3-GND 1.46,-36.61 1.46,-35.72 | 1.46,-35.72 -8.7,-35.72 | 1.46,-35.72 11.62,-35.72 11.62,-36.61 L5.3-GND 13.46,-38.36 C5.2
N$1
  Top 0.406: L1.2-DOUT -22.07,-36.61 L2.4-DIN
N$2
  Top 0.406: L2.2-DOUT -11.91,-36.61 L3.4-DIN
N$3
  Top 0.406: L3.2-DOUT -1.75,-36.61 L4.4-DIN
N$4
  Top 0.406: L4.2-DOUT 8.41,-36.61 L5.4-DIN
N$5  (1 unrouted)
N$6  (1 unrouted)
N$7  (1 unrouted)
N$8  (1 unrouted)
N$9  (1 unrouted)
N$10  (1 unrouted)
N$13  (1 unrouted)
N$14  (1 unrouted)
N$15  (1 unrouted)
N$16  (1 unrouted)
N$17  (1 unrouted)
N$18  (1 unrouted)
N$19  (1 unrouted)
N$20  (1 unrouted)
N$21  (1 unrouted)
N$22  (1 unrouted)
N$23  (1 unrouted)
N$24  (1 unrouted)
N$27  (1 unrouted)
N$28  (1 unrouted)
N$29  (1 unrouted)
N$30  (1 unrouted)
N$31  (1 unrouted)
N$32  (1 unrouted)
N$33  (1 unrouted)
N$34  (1 unrouted)
N$35  (1 unrouted)
N$36  (1 unrouted)
N$39  (1 unrouted)
N$40  (1 unrouted)
N$41  (1 unrouted)
N$42  (1 unrouted)
N$43  (1 unrouted)
N$44  (1 unrouted)
N$45  (1 unrouted)
N$46  (1 unrouted)
N$47  (1 unrouted)
N$48  (1 unrouted)
N$51  (1 unrouted)
N$52  (1 unrouted)
N$53  (1 unrouted)
N$54  (1 unrouted)
N$55  (1 unrouted)
N$56  (1 unrouted)
N$57  (1 unrouted)
N$58  (1 unrouted)
N$59  (1 unrouted)
N$60  (1 unrouted)
N$63  (1 unrouted)
N$64  (1 unrouted)
N$65  (1 unrouted)
N$66  (1 unrouted)
N$67  (1 unrouted)
N$68  (1 unrouted)
N$69  (1 unrouted)
N$70  (1 unrouted)
N$71  (1 unrouted)
N$72  (1 unrouted)
N$75  (1 unrouted)
N$76  (1 unrouted)
N$77  (1 unrouted)
N$78  (1 unrouted)
N$79  (1 unrouted)
N$80  (1 unrouted)
N$81  (1 unrouted)
N$82  (1 unrouted)
N$83  (1 unrouted)
N$84  (1 unrouted)
N$87  (1 unrouted)
N$88  (1 unrouted)
N$89  (1 unrouted)
N$90  (1 unrouted)
N$91  (1 unrouted)
N$92  (1 unrouted)
N$93  (1 unrouted)
N$94  (1 unrouted)
N$95  (1 unrouted)
N$96  (1 unrouted)
N$99  (1 unrouted)
N$100  (1 unrouted)
N$101  (1 unrouted)
N$102  (1 unrouted)
N$103  (1 unrouted)
N$104  (1 unrouted)
N$105  (1 unrouted)
N$106  (1 unrouted)
N$107  (1 unrouted)
N$108  (1 unrouted)
N$111  (1 unrouted)
N$112  (1 unrouted)
N$113  (1 unrouted)
N$114  (1 unrouted)
N$115  (1 unrouted)
N$116  (1 unrouted)
N$117  (1 unrouted)
N$118  (1 unrouted)
N$119  (1 unrouted)
N$120  (1 unrouted)